# EAGLE design xmas_tree_pcb_A (EAGLE 6.3)
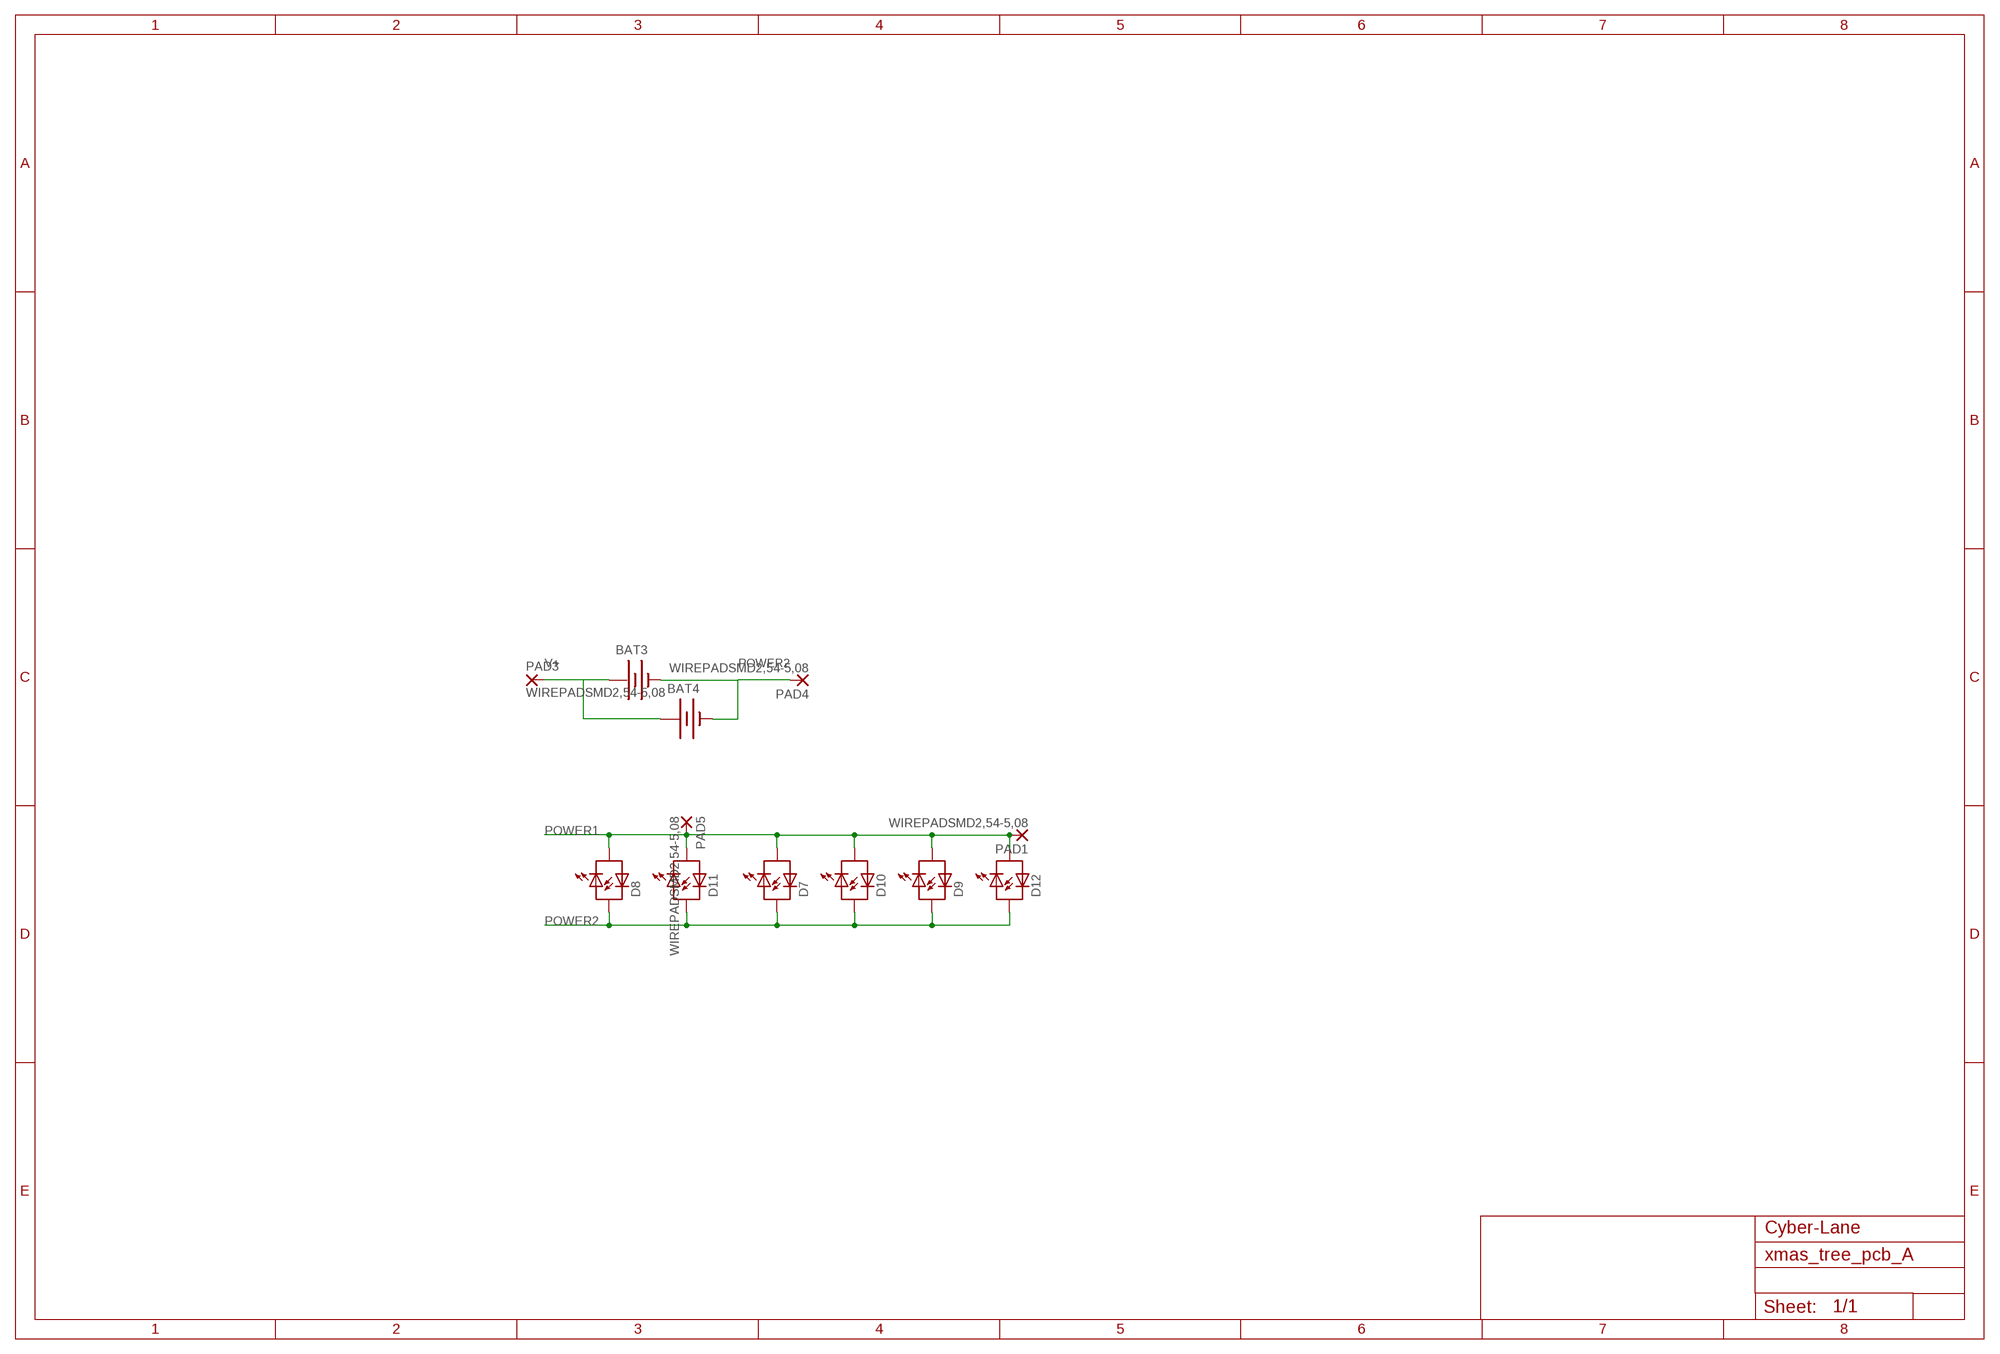
[diagram p0: schematic, sheet 1]

## Parts
BAT3  BATTERY20PTH  [BATTCOM_20MM_PTH]
BAT4  BATTERY20PTH  [BATTCOM_20MM_PTH]
D7  LED_BI_COLOR  [LED3MM]
D8  LED_BI_COLOR  [LED3MM]
D9  LED_BI_COLOR  [LED3MM]
D10  LED_BI_COLOR  [LED3MM]
D11  LED_BI_COLOR  [LED3MM]
D12  LED_BI_COLOR  [LED3MM]
PAD1  WIREPADSMD2,54-5,08  [SMD2,54-5,08]
PAD3  WIREPADSMD2,54-5,08  [SMD2,54-5,08]
PAD4  WIREPADSMD2,54-5,08  [SMD2,54-5,08]
PAD5  WIREPADSMD2,54-5,08  [SMD2,54-5,08]

## Nets
POWER1: D7.K(C1) D8.K(C1) D9.K(C1) D10.K(C1) D11.K(C1) D12.K(C1) PAD1.1(P) PAD5.1(P)
POWER2: BAT3.2(-) BAT4.2(-) D7.A(A1) D8.A(A1) D9.A(A1) D10.A(A1) D11.A(A1) D12.A(A1) PAD4.1(P)
V+: BAT3.1(+) BAT4.1(+) PAD3.1(P)

## Notes on the sheet
- Cyber-Lane

## Library data of the parts
BAT3 BAT4 = SparkFun:BATTERY: Battery Holders Various common sizes : AA, AAA, 20mm coin cell and 12mm coin cell.
D7-D12 = SparkFun_mod:LED_BI_COLOR
PAD1 PAD3-PAD5 = wirepad:WIREPAD: Wire PAD connect wire on PCB

## Board
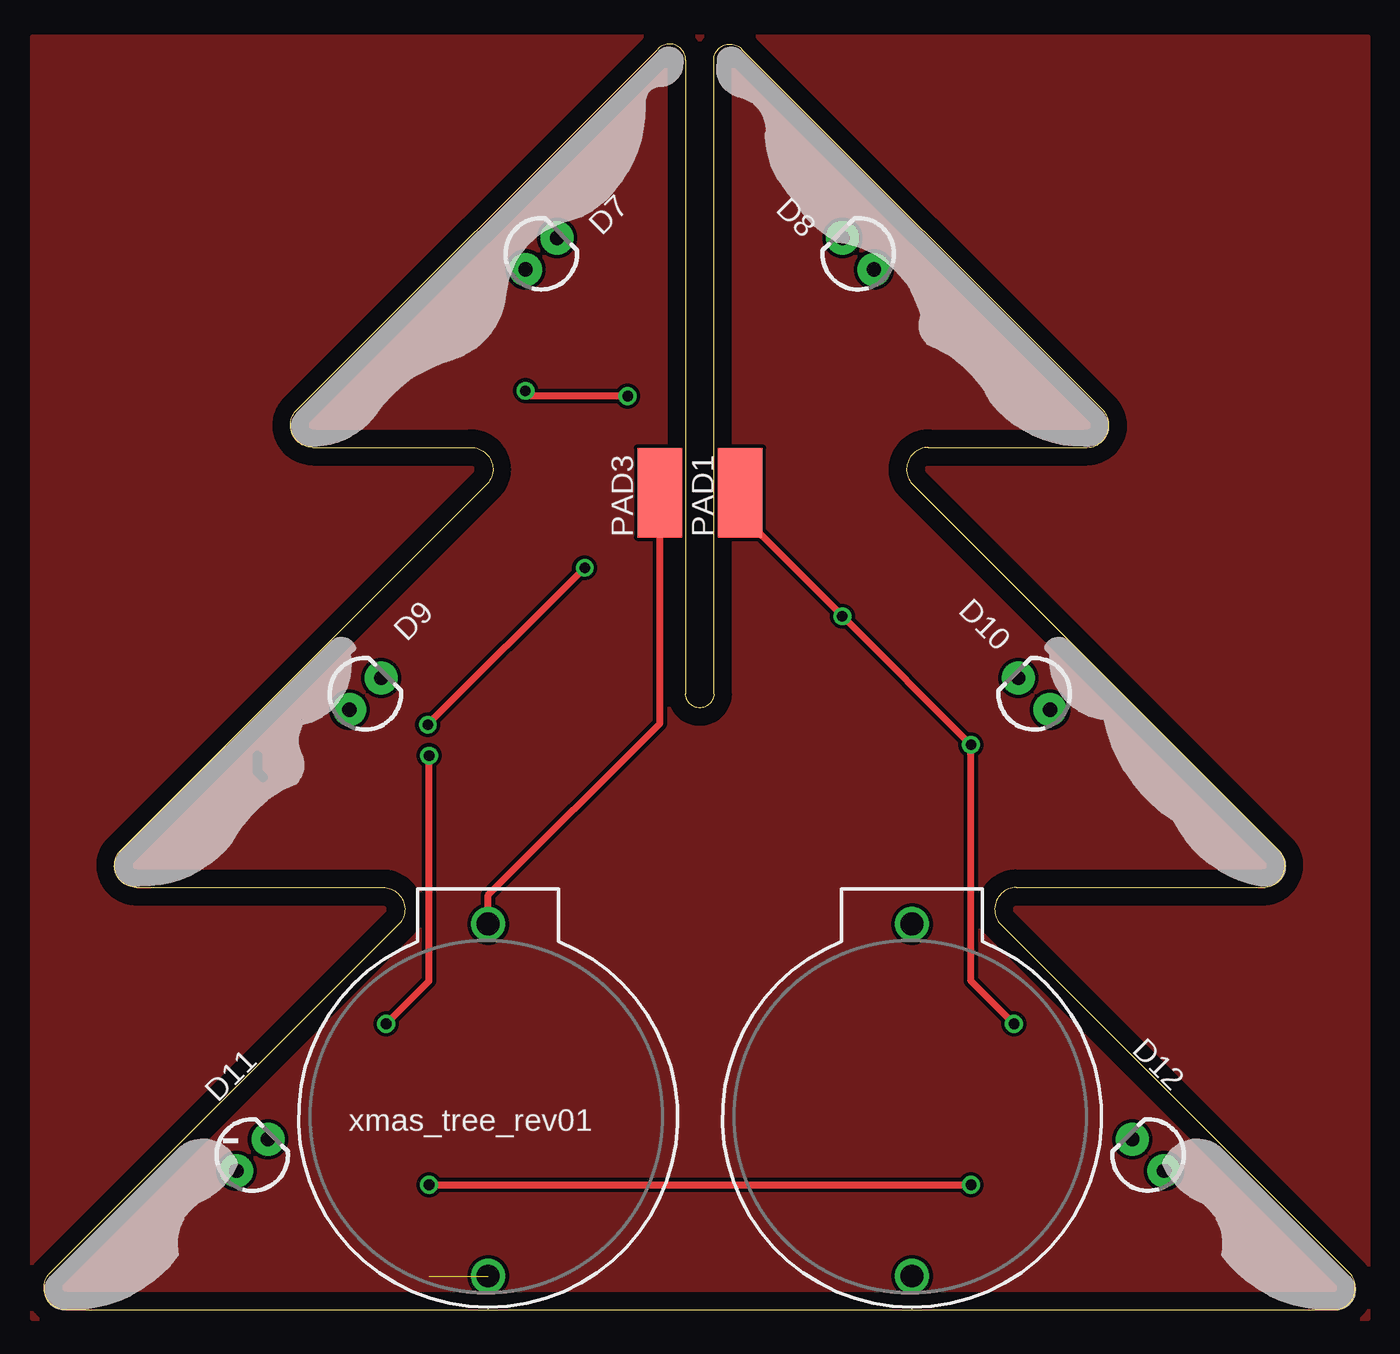
[diagram p1: board, top side]
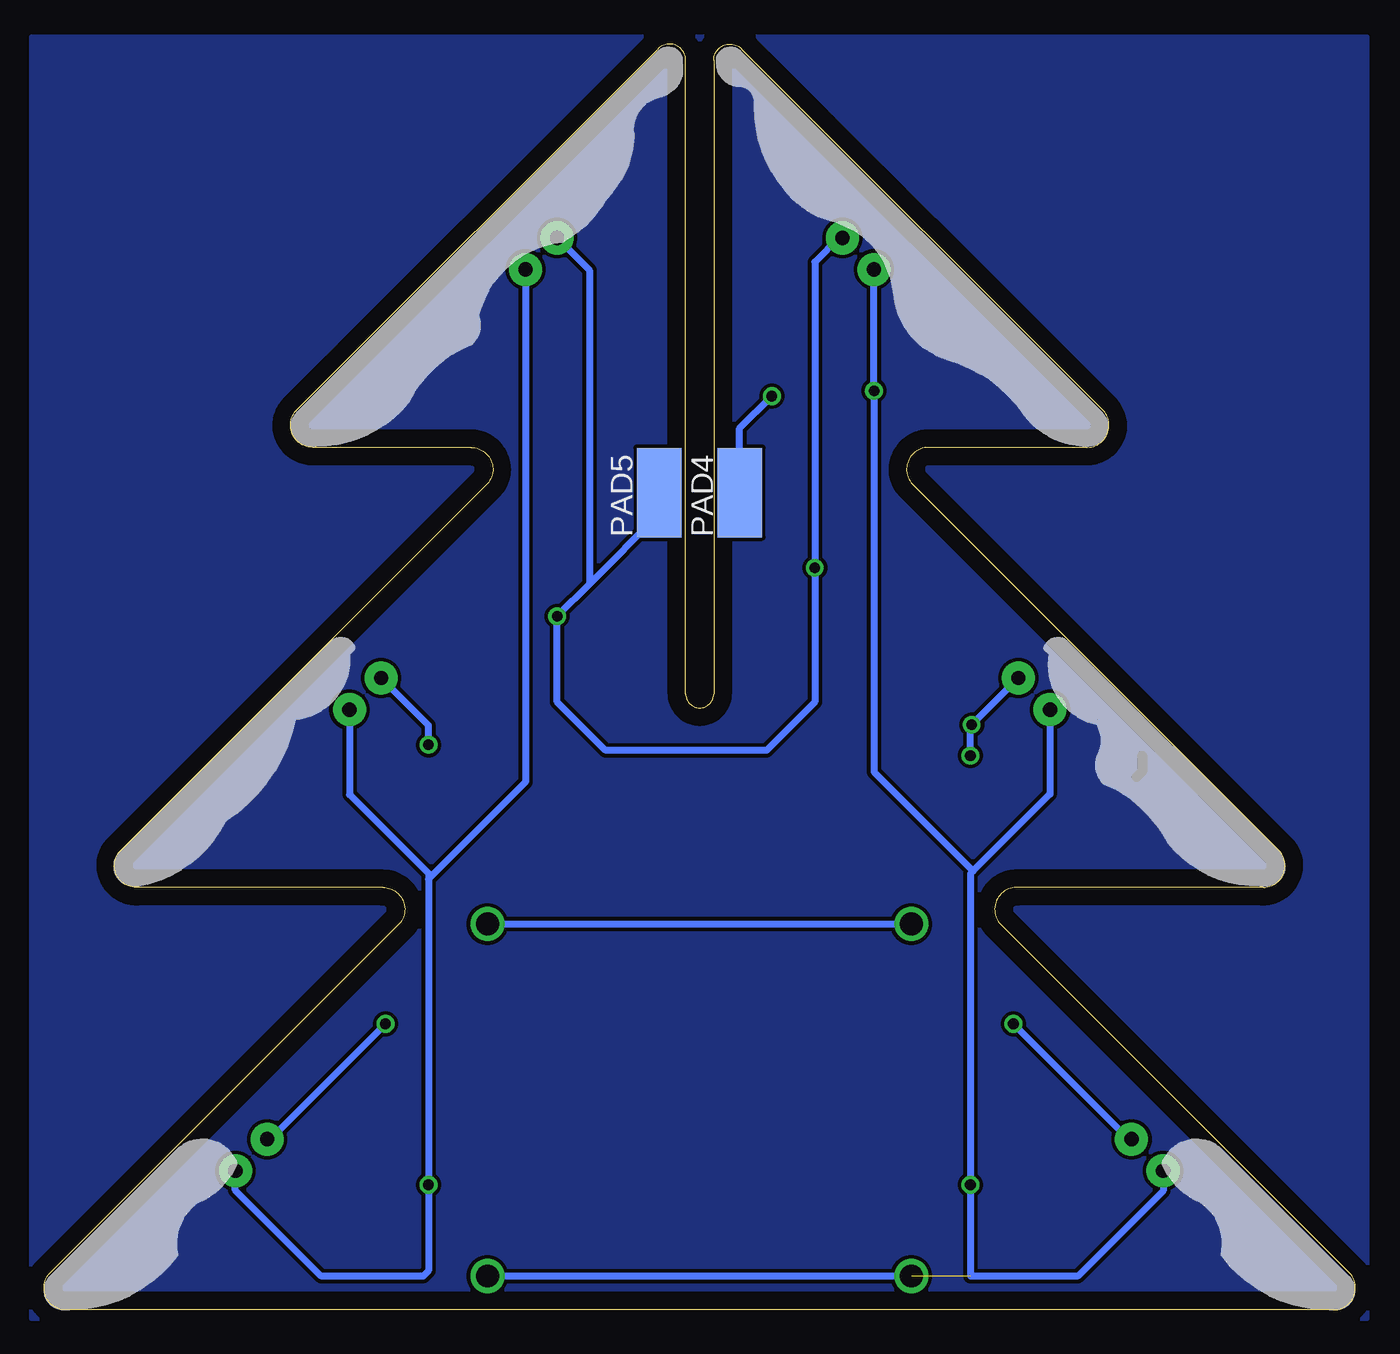
[diagram p2: board, bottom side, seen from below]

Size 74.5 x 71.91 mm. Coordinates in mm from the lower left corner, seen from the top.
Outline: 55.25,24 69.25,24 arc127 70.25,26 49.25,47 arc-127 50.25,49 59.25,49 arc127 60.25,51 39.65,71.6 arc139 38.05,71 38.05,35 arc-180 36.45,35 36.45,71 arc139 34.85,71.6 14.25,51 arc127 15.25,49 24.25,49 arc-127 25.25,47 4.25,26 arc127 5.25,24 19.25,24 arc-127 20.25,22 0.25,2 arc127 1.25,0 73.25,0 arc127 74.25,2 54.25,22 arc-127 55.25,24
Copper layers (1*16): Top 0.035mm / dielectric 1.5mm / Bottom 0.035mm
Design rules "default": minimum track width 10mil, minimum drill 20mil, track to track 8mil, track to pad 8mil, pad to pad 6mil, via to via 8mil, smd to smd 6mil, copper to edge 40mil, drill to drill 8mil, minimum pad ring 10mil, minimum via ring 8mil, stop-mask expansion 4mil, vias tented up to drill 20mil, thermal gap 10mil
tRestrict: 2 lines
bRestrict: 2 lines

### Footprints (pad centres in the part's own frame; a part is rotated, then mirrored left to right if it is on the bottom)
BATTCOM_20MM_PTH = drill 1.3: 1 20,0; 2 0,0
LED3MM = drill 0.813 pad 1.88: A -1.27,0; K 1.27,0
SMD2,54-5,08 = smd 2.54 x 5.08: 1 0,0

### Placement (x,y rotation side)
BAT3  25.23,1.92 90 top
BAT4  49.31,1.92 90 top
D7  28.25,60 45 top
D8  46.25,60 135 top
D9  18.25,35 45 top
D10  56.25,35 135 top
D11  11.83,8.8 45 top
D12  62.72,8.8 135 top
PAD1  39.55,46.43 0 top
PAD3  34.98,46.43 0 top
PAD4  34.98,46.43 0 bottom
PAD5  39.55,46.43 0 bottom

### Tracks (layer width: path | path; a pad name or v marks a point on that pad's centre or on a via)
NA
  pour Bottom (isolate 0.152): -0.68,-0.51 75.21,-0.51 75.21,72.33 -0.68,72.33
  pour Top (isolate 0.152): -0.68,-0.51 -0.68,72.33 75.21,72.33 75.21,-0.51
POWER1  (via drill 0.6)
  Top 0.406: v19.44,16.25 21.87,18.69 v21.87,31.49 | v55.1,16.25 52.66,18.69 v52.66,32.1 v45.35,39.41 40.77,43.99 39.55,45.21 PAD1.1 | v30.71,42.16 v21.8,33.25
  Bottom 0.406: D11.K 12.88,9.7 v19.44,16.25 | v21.87,31.49 21.87,33.17 v21.8,33.25 D9.K | D12.K 61.65,9.7 v55.1,16.25 | v52.66,32.1 52.66,33.2 D10.K | D7.K 29.35,60.9 30.71,59.53 v30.71,42.16 30.71,34.54 33.46,31.8 42.6,31.8 45.34,34.54 45.34,39.4 v45.35,39.41 43.51,41.24 | D8.K 43.51,59.06 43.51,41.24 | PAD1.1 39.55,45.21 43.51,41.24
POWER2  (via drill 0.6)  (1 unrouted)
  Top 0.406: v21.87,7.11 v52.66,7.11 | v33.15,51.91 27.66,51.91 v27.35,52.22
  Bottom 0.406: D11.A 10.93,6.77 15.78,1.92 21.87,1.92 v21.87,7.11 21.87,24.79 21.72,24.94 | D12.A 63.63,7.89 63.63,6.8 58.75,1.92 52.96,1.92 52.66,2.23 v52.66,7.11 52.66,24.48 | D9.A 17.35,29.31 21.72,24.94 | D10.A 57.15,29.27 52.66,24.79 52.66,24.48 | 21.72,24.94 27.35,30.57 v27.35,52.22 D7.A | D8.A 47.15,29.99 52.66,24.48 | BAT3.2 BAT4.2 | PAD4.1 34.98,50.08 v33.15,51.91
V+
  Top 0.406: BAT3.1 25.23,23.57 34.98,33.32 PAD3.1
  Bottom 0.406: BAT4.1 BAT3.1

### Text on the board
tPlace: xmas_tree_rev01 | -